# EAGLE schematic Line Detector (EAGLE 9.6.2)
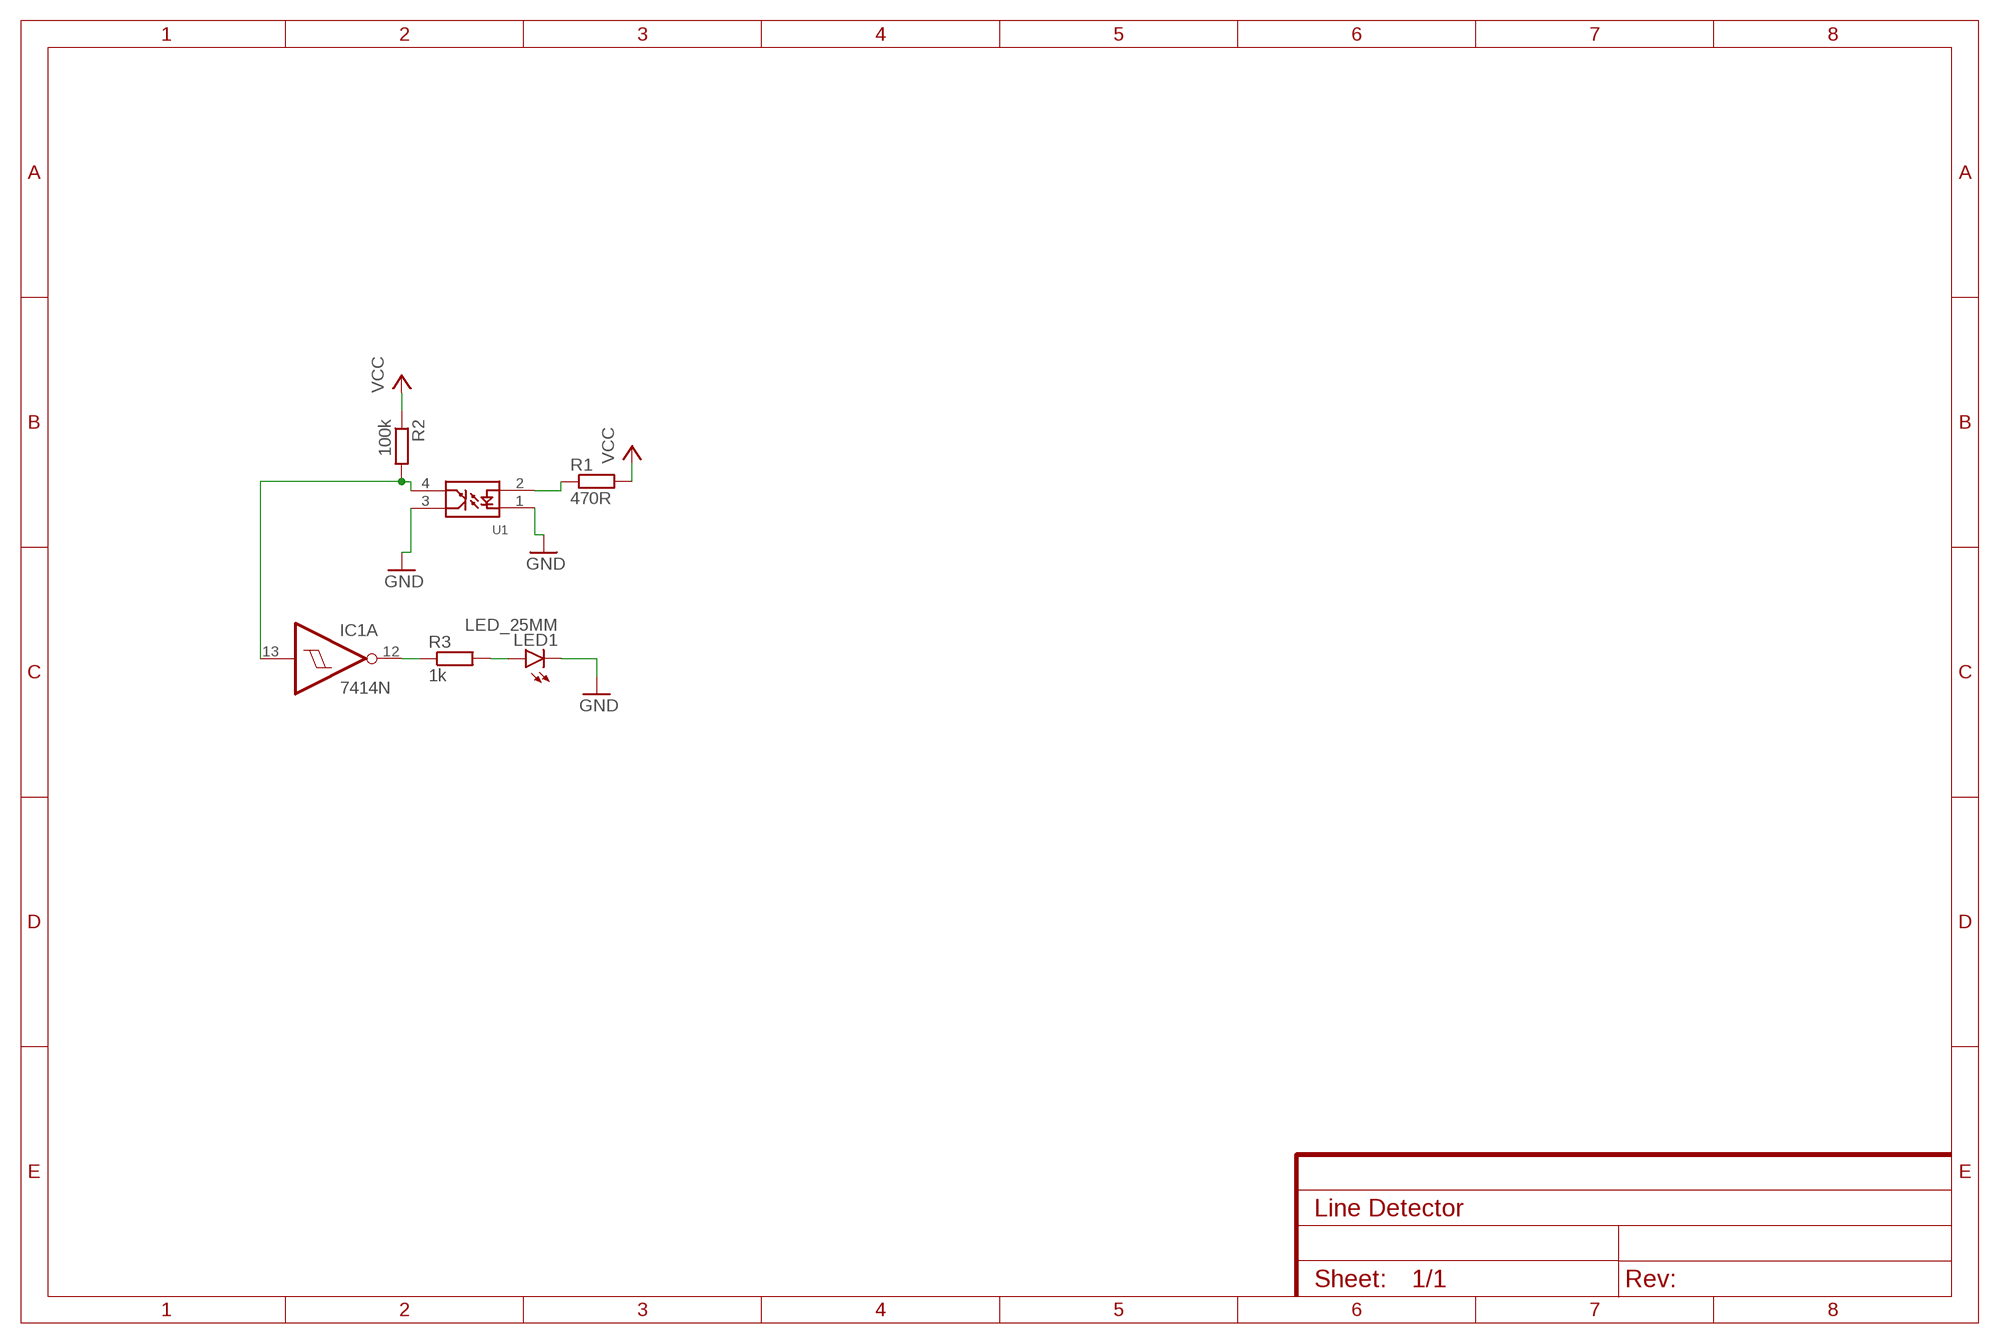
[diagram p0: schematic, sheet 1]

## Parts
IC1  7414N  [DIL14]
LED1  LED_25MM  [LED5MM]
R1  470R  R-EU_0204/7  [0204/7]
R2  100k  R-EU_0204/7  [0204/7]
R3  1k  R-EU_0204/7  [0204/7]
U1  OPB704  [22-23-2041]

## Nets
GND: LED1.K(C) U1.1 U1.3
N$1: R1.1 U1.2
N$3: IC1.12(A:O) R3.1
N$4: LED1.A R3.2
N$5: IC1.13(A:I) R2.2 U1.4
VCC: R1.2 R2.1
Unconnected: IC1.1(D:I) IC1.2(D:O) IC1.3(E:I) IC1.4(E:O) IC1.5(F:I) IC1.6(F:O) IC1.8(C:O) IC1.9(C:I) IC1.10(B:O) IC1.11(B:I)

## Power pins joined to a net without a drawn wire
GND: IC1.7(P:GND)
VCC: IC1.14(P:VCC)

## Library data of the parts
IC1 = IDP_library:74*14: Hex schmitt trigger INVERTER
LED1 = IDP_library:LED_2: LED
R1-R3 = IDP_library:R-EU_: RESISTOR, European symbol; SPICEPREFIX: R
U1 = IDP_library:OPB704: 314020022